# Altium schematic sheet uc3c.SchDoc
size Tabloid
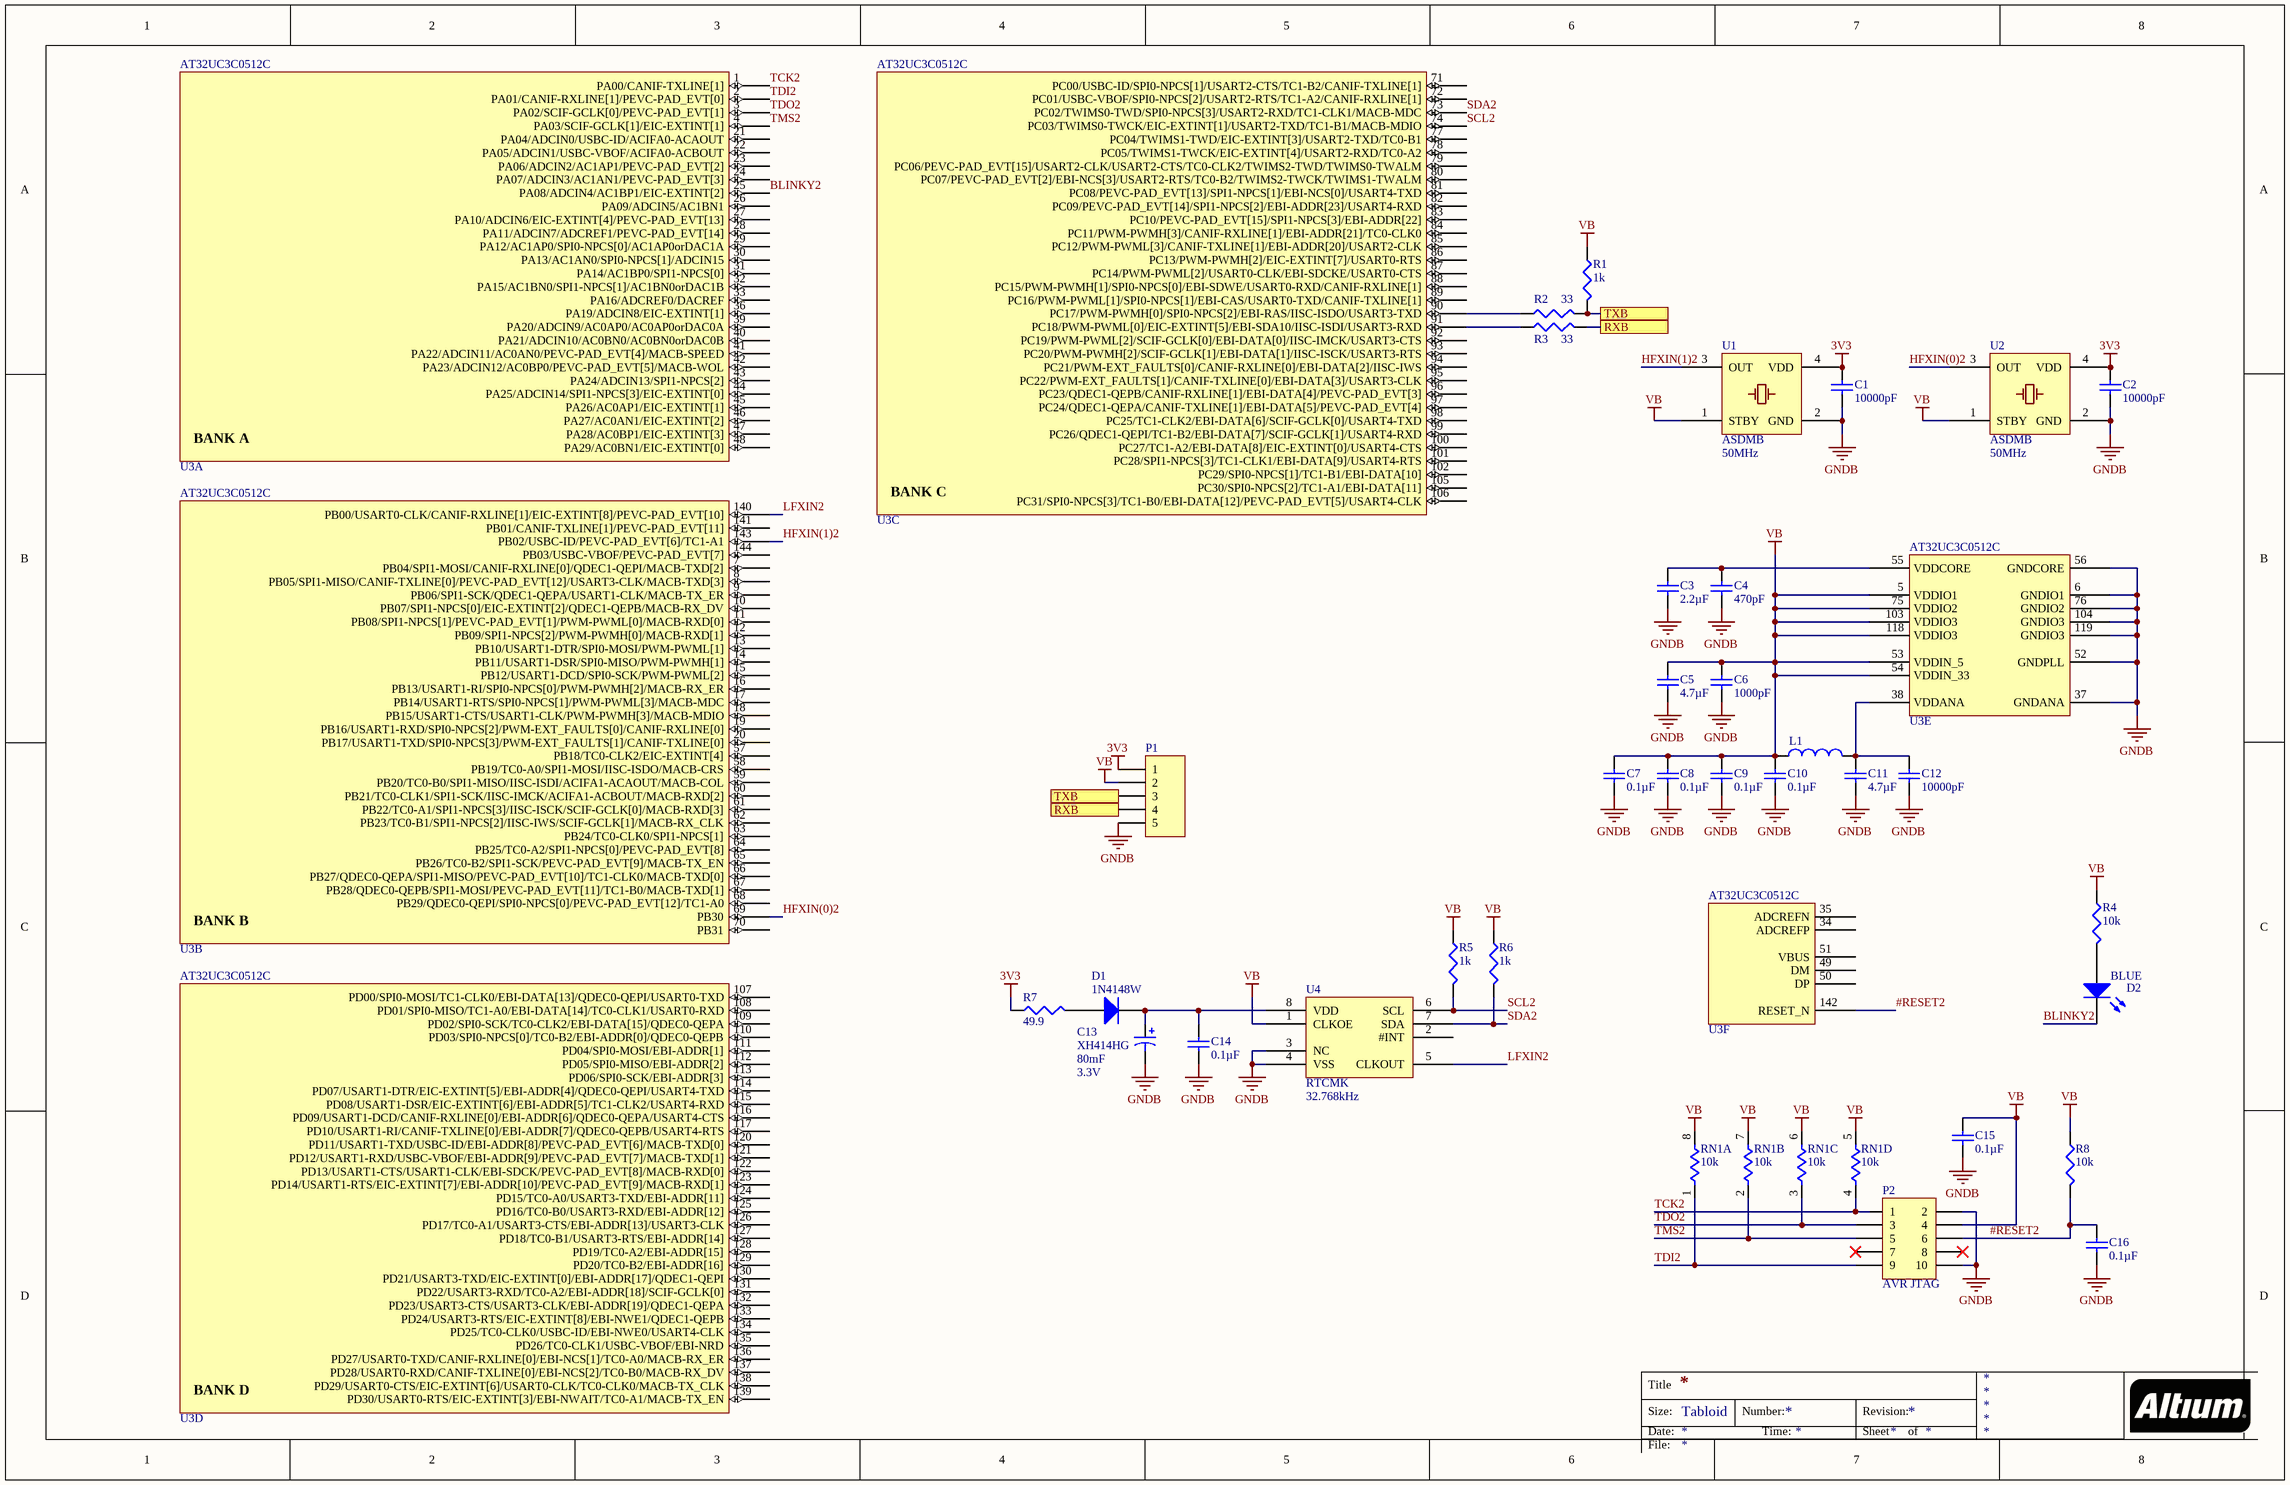
[diagram p0: uc3c.SchDoc]

## Parts
C1  value 10000pF  [TDK-CGA3E]  (hidden comment: Cap)
C2  value 10000pF  [TDK-CGA3E]  (hidden comment: Cap)
C3  value 2.2µF  [TDK-CGA3E]  (hidden comment: Cap)
C4  value 470pF  [TDK-CGA3E]  (hidden comment: Cap)
C5  value 4.7µF  [TDK-CGA4J]  (hidden comment: Cap)
C6  value 1000pF  [TDK-CGA3E]  (hidden comment: Cap)
C7  value 0.1µF  [TDK-CGA3E]  (hidden comment: Cap)
C8  value 0.1µF  [TDK-CGA3E]  (hidden comment: Cap)
C9  value 0.1µF  [TDK-CGA3E]  (hidden comment: Cap)
C10  value 0.1µF  [TDK-CGA3E]  (hidden comment: Cap)
C11  value 4.7µF  [TDK-CGA4J]  (hidden comment: Cap)
C12  value 10000pF  [TDK-CGA3E]  (hidden comment: Cap)
C13  XH414HG  value 80mF  Voltage - Rated: 3.3V  [SKI-XH414HG-IV01E]
C14  value 0.1µF  [TDK-CGA3E]  (hidden comment: Cap)
C15  value 0.1µF  [TDK-CGA3E]  (hidden comment: Cap)
C16  value 0.1µF  [TDK-CGA3E]  (hidden comment: Cap)
D1  1N4148W  [DIOD-SOD123]
D2  value BLUE  [WL-150060XS75000]  (hidden comment: LED)
L1  Inductor  [TDK-MPX1608]  (value not drawn)
P1  319-10-105-30-054000  [319-10-105-30-054000]  (value not drawn)
P2  Header 5x2  [SLN-GRPB052]  (value not drawn)
R1  value 1k  [PANA-ERJ3EK]  (hidden comment: Res3)
R2  value 33  [PANA-ERJ3EK]  (hidden comment: Res3)
R3  value 33  [PANA-ERJ3EK]  (hidden comment: Res3)
R4  value 10k  [PANA-ERJ3EK]  (hidden comment: Res3)
R5  value 1k  [PANA-ERJ3EK]  (hidden comment: Res3)
R6  value 1k  [PANA-ERJ3EK]  (hidden comment: Res3)
R7  value 49.9  [PANA-ERJ3EK]  (hidden comment: Res3)
R8  value 10k  [PANA-ERJ3EK]  (hidden comment: Res3)
RN1  value 10k  [PANA-EXB1206]  (hidden comment: Res4 Pack1)  (parts A,B,C,D of 4)
U1  ASDMB  value 50MHz  [ABR-ASDMB]
U2  ASDMB  value 50MHz  [ABR-ASDMB]
U3  AT32UC3C0512C  [MCP-LQFP144]  (parts A,B,C,D,E,F of 6)
U4  RTCMK  value 32.768kHz  [ABR-RTCMK]

## Ports
RXB, TXB

## Nets
3V3: C1.2 C2.2 P1.1 R7.2 U1.4(VDD) U2.4(VDD)
GNDB: C1.1 C2.1 C3.1 C4.1 C5.1 C6.1 C7.1 C8.1 C9.1 C10.1 C11.1 C12.1 C13.2 C14.1 C15.1 C16.2 P1.5 P2.2 P2.10 U1.2(GND) U2.2(GND) U3.6(GNDIO1) U3.37(GNDANA) U3.52(GNDPLL) U3.56(GNDCORE) U3.76(GNDIO2) U3.104(GNDIO3) U3.119(GNDIO3) U4.3(NC) U4.4(VSS)
VB: C5.2 C6.2 C7.2 C8.2 C9.2 C10.2 C15.2 L1.1 P1.2 P2.4 R1.2 R4.2 R5.2 R6.2 R8.1 RN1.5 RN1.6 RN1.7 RN1.8 U1.1(STBY) U2.1(STBY) U3.5(VDDIO1) U3.53(VDDIN_5) U3.54(VDDIN_33) U3.75(VDDIO2) U3.103(VDDIO3) U3.118(VDDIO3) U4.1(CLKOE)
#RESET2: C16.1 P2.6 R8.2 U3.142(RESET_N)
BLINKY2: D2.2(K) U3.25(PA08/ADCIN4/AC1BP1/EIC-EXTINT[2])
HFXIN(0)2: U2.3(OUT) U3.69(PB30)
HFXIN(1)2: U1.3(OUT) U3.143(PB02/USBC-ID/PEVC-PAD_EVT[6]/TC1-A1)
LFXIN2: U3.140(PB00/USART0-CLK/CANIF-RXLINE[1]/EIC-EXTINT[8]/PEVC-PAD_EVT[10]) U4.5(CLKOUT)
RXB: P1.4 R3.2 ; port RXB
SCL2: R5.1 U3.74(PC03/TWIMS0-TWCK/EIC-EXTINT[1]/USART2-TXD/TC1-B1/MACB-MDIO) U4.6(SCL)
SDA2: R6.1 U3.73(PC02/TWIMS0-TWD/SPI0-NPCS[3]/USART2-RXD/TC1-CLK1/MACB-MDC) U4.7(SDA)
TCK2: P2.1 RN1.4 U3.1(PA00/CANIF-TXLINE[1])
TDI2: P2.9 RN1.1 U3.2(PA01/CANIF-RXLINE[1]/PEVC-PAD_EVT[0])
TDO2: P2.3 RN1.3 U3.3(PA02/SCIF-GCLK[0]/PEVC-PAD_EVT[1])
TMS2: P2.5 RN1.2 U3.4(PA03/SCIF-GCLK[1]/EIC-EXTINT[1])
TXB: P1.3 R1.1 R2.2 ; port TXB
NetC3_2: C3.2 C4.2 U3.55(VDDCORE)
NetC11_2: C11.2 C12.2 L1.2 U3.38(VDDANA)
NetC13_1: C13.1 C14.2 D1.2(K) U4.8(VDD)
NetD1_1: D1.1(A) R7.1
NetD2_1: D2.1(A) R4.1
NetR2_1: R2.1 U3.90(PC17/PWM-PWMH[0]/SPI0-NPCS[2]/EBI-RAS/IISC-ISDO/USART3-TXD)
NetR3_1: R3.1 U3.91(PC18/PWM-PWML[0]/EIC-EXTINT[5]/EBI-SDA10/IISC-ISDI/USART3-RXD)

Not connected (* = marked no-connect by the designer): P2 7* 8*; U3 7(PB04/SPI1-MOSI/CANIF-RXLINE[0]/QDEC1-QEPI/MACB-TXD[2]) 8(PB05/SPI1-MISO/CANIF-TXLINE[0]/PEVC-PAD_EVT[12]/USART3-CLK/MACB-TXD[3]) 9(PB06/SPI1-SCK/QDEC1-QEPA/USART1-CLK/MACB-TX_ER) 10(PB07/SPI1-NPCS[0]/EIC-EXTINT[2]/QDEC1-QEPB/MACB-RX_DV) 11(PB08/SPI1-NPCS[1]/PEVC-PAD_EVT[1]/PWM-PWML[0]/MACB-RXD[0]) 12(PB09/SPI1-NPCS[2]/PWM-PWMH[0]/MACB-RXD[1]) 13(PB10/USART1-DTR/SPI0-MOSI/PWM-PWML[1]) 14(PB11/USART1-DSR/SPI0-MISO/PWM-PWMH[1]) 15(PB12/USART1-DCD/SPI0-SCK/PWM-PWML[2]) 16(PB13/USART1-RI/SPI0-NPCS[0]/PWM-PWMH[2]/MACB-RX_ER) 17(PB14/USART1-RTS/SPI0-NPCS[1]/PWM-PWML[3]/MACB-MDC) 18(PB15/USART1-CTS/USART1-CLK/PWM-PWMH[3]/MACB-MDIO) 19(PB16/USART1-RXD/SPI0-NPCS[2]/PWM-EXT_FAULTS[0]/CANIF-RXLINE[0]) 20(PB17/USART1-TXD/SPI0-NPCS[3]/PWM-EXT_FAULTS[1]/CANIF-TXLINE[0]) 21(PA04/ADCIN0/USBC-ID/ACIFA0-ACAOUT) 22(PA05/ADCIN1/USBC-VBOF/ACIFA0-ACBOUT) 23(PA06/ADCIN2/AC1AP1/PEVC-PAD_EVT[2]) 24(PA07/ADCIN3/AC1AN1/PEVC-PAD_EVT[3]) 26(PA09/ADCIN5/AC1BN1) 27(PA10/ADCIN6/EIC-EXTINT[4]/PEVC-PAD_EVT[13]) 28(PA11/ADCIN7/ADCREF1/PEVC-PAD_EVT[14]) 29(PA12/AC1AP0/SPI0-NPCS[0]/AC1AP0orDAC1A) 30(PA13/AC1AN0/SPI0-NPCS[1]/ADCIN15) 31(PA14/AC1BP0/SPI1-NPCS[0]) 32(PA15/AC1BN0/SPI1-NPCS[1]/AC1BN0orDAC1B) 33(PA16/ADCREF0/DACREF) 34(ADCREFP) 35(ADCREFN) 36(PA19/ADCIN8/EIC-EXTINT[1]) 39(PA20/ADCIN9/AC0AP0/AC0AP0orDAC0A) 40(PA21/ADCIN10/AC0BN0/AC0BN0orDAC0B) 41(PA22/ADCIN11/AC0AN0/PEVC-PAD_EVT[4]/MACB-SPEED) 42(PA23/ADCIN12/AC0BP0/PEVC-PAD_EVT[5]/MACB-WOL) 43(PA24/ADCIN13/SPI1-NPCS[2]) 44(PA25/ADCIN14/SPI1-NPCS[3]/EIC-EXTINT[0]) 45(PA26/AC0AP1/EIC-EXTINT[1]) 46(PA27/AC0AN1/EIC-EXTINT[2]) 47(PA28/AC0BP1/EIC-EXTINT[3]) 48(PA29/AC0BN1/EIC-EXTINT[0]) 49(DM) 50(DP) 51(VBUS) 57(PB18/TC0-CLK2/EIC-EXTINT[4]) 58(PB19/TC0-A0/SPI1-MOSI/IISC-ISDO/MACB-CRS) 59(PB20/TC0-B0/SPI1-MISO/IISC-ISDI/ACIFA1-ACAOUT/MACB-COL) 60(PB21/TC0-CLK1/SPI1-SCK/IISC-IMCK/ACIFA1-ACBOUT/MACB-RXD[2]) 61(PB22/TC0-A1/SPI1-NPCS[3]/IISC-ISCK/SCIF-GCLK[0]/MACB-RXD[3]) 62(PB23/TC0-B1/SPI1-NPCS[2]/IISC-IWS/SCIF-GCLK[1]/MACB-RX_CLK) 63(PB24/TC0-CLK0/SPI1-NPCS[1]) 64(PB25/TC0-A2/SPI1-NPCS[0]/PEVC-PAD_EVT[8]) 65(PB26/TC0-B2/SPI1-SCK/PEVC-PAD_EVT[9]/MACB-TX_EN) 66(PB27/QDEC0-QEPA/SPI1-MISO/PEVC-PAD_EVT[10]/TC1-CLK0/MACB-TXD[0]) 67(PB28/QDEC0-QEPB/SPI1-MOSI/PEVC-PAD_EVT[11]/TC1-B0/MACB-TXD[1]) 68(PB29/QDEC0-QEPI/SPI0-NPCS[0]/PEVC-PAD_EVT[12]/TC1-A0) 70(PB31) 71(PC00/USBC-ID/SPI0-NPCS[1]/USART2-CTS/TC1-B2/CANIF-TXLINE[1]) 72(PC01/USBC-VBOF/SPI0-NPCS[2]/USART2-RTS/TC1-A2/CANIF-RXLINE[1]) 77(PC04/TWIMS1-TWD/EIC-EXTINT[3]/USART2-TXD/TC0-B1) 78(PC05/TWIMS1-TWCK/EIC-EXTINT[4]/USART2-RXD/TC0-A2) 79(PC06/PEVC-PAD_EVT[15]/USART2-CLK/USART2-CTS/TC0-CLK2/TWIMS2-TWD/TWIMS0-TWALM) 80(PC07/PEVC-PAD_EVT[2]/EBI-NCS[3]/USART2-RTS/TC0-B2/TWIMS2-TWCK/TWIMS1-TWALM) 81(PC08/PEVC-PAD_EVT[13]/SPI1-NPCS[1]/EBI-NCS[0]/USART4-TXD) 82(PC09/PEVC-PAD_EVT[14]/SPI1-NPCS[2]/EBI-ADDR[23]/USART4-RXD) 83(PC10/PEVC-PAD_EVT[15]/SPI1-NPCS[3]/EBI-ADDR[22]) 84(PC11/PWM-PWMH[3]/CANIF-RXLINE[1]/EBI-ADDR[21]/TC0-CLK0) 85(PC12/PWM-PWML[3]/CANIF-TXLINE[1]/EBI-ADDR[20]/USART2-CLK) 86(PC13/PWM-PWMH[2]/EIC-EXTINT[7]/USART0-RTS) 87(PC14/PWM-PWML[2]/USART0-CLK/EBI-SDCKE/USART0-CTS) 88(PC15/PWM-PWMH[1]/SPI0-NPCS[0]/EBI-SDWE/USART0-RXD/CANIF-RXLINE[1]) 89(PC16/PWM-PWML[1]/SPI0-NPCS[1]/EBI-CAS/USART0-TXD/CANIF-TXLINE[1]) 92(PC19/PWM-PWML[2]/SCIF-GCLK[0]/EBI-DATA[0]/IISC-IMCK/USART3-CTS) 93(PC20/PWM-PWMH[2]/SCIF-GCLK[1]/EBI-DATA[1]/IISC-ISCK/USART3-RTS) 94(PC21/PWM-EXT_FAULTS[0]/CANIF-RXLINE[0]/EBI-DATA[2]/IISC-IWS) 95(PC22/PWM-EXT_FAULTS[1]/CANIF-TXLINE[0]/EBI-DATA[3]/USART3-CLK) 96(PC23/QDEC1-QEPB/CANIF-RXLINE[1]/EBI-DATA[4]/PEVC-PAD_EVT[3]) 97(PC24/QDEC1-QEPA/CANIF-TXLINE[1]/EBI-DATA[5]/PEVC-PAD_EVT[4]) 98(PC25/TC1-CLK2/EBI-DATA[6]/SCIF-GCLK[0]/USART4-TXD) 99(PC26/QDEC1-QEPI/TC1-B2/EBI-DATA[7]/SCIF-GCLK[1]/USART4-RXD) 100(PC27/TC1-A2/EBI-DATA[8]/EIC-EXTINT[0]/USART4-CTS) 101(PC28/SPI1-NPCS[3]/TC1-CLK1/EBI-DATA[9]/USART4-RTS) 102(PC29/SPI0-NPCS[1]/TC1-B1/EBI-DATA[10]) 105(PC30/SPI0-NPCS[2]/TC1-A1/EBI-DATA[11]) 106(PC31/SPI0-NPCS[3]/TC1-B0/EBI-DATA[12]/PEVC-PAD_EVT[5]/USART4-CLK) 107(PD00/SPI0-MOSI/TC1-CLK0/EBI-DATA[13]/QDEC0-QEPI/USART0-TXD) 108(PD01/SPI0-MISO/TC1-A0/EBI-DATA[14]/TC0-CLK1/USART0-RXD) 109(PD02/SPI0-SCK/TC0-CLK2/EBI-DATA[15]/QDEC0-QEPA) 110(PD03/SPI0-NPCS[0]/TC0-B2/EBI-ADDR[0]/QDEC0-QEPB) 111(PD04/SPI0-MOSI/EBI-ADDR[1]) 112(PD05/SPI0-MISO/EBI-ADDR[2]) 113(PD06/SPI0-SCK/EBI-ADDR[3]) 114(PD07/USART1-DTR/EIC-EXTINT[5]/EBI-ADDR[4]/QDEC0-QEPI/USART4-TXD) 115(PD08/USART1-DSR/EIC-EXTINT[6]/EBI-ADDR[5]/TC1-CLK2/USART4-RXD) 116(PD09/USART1-DCD/CANIF-RXLINE[0]/EBI-ADDR[6]/QDEC0-QEPA/USART4-CTS) 117(PD10/USART1-RI/CANIF-TXLINE[0]/EBI-ADDR[7]/QDEC0-QEPB/USART4-RTS) 120(PD11/USART1-TXD/USBC-ID/EBI-ADDR[8]/PEVC-PAD_EVT[6]/MACB-TXD[0]) 121(PD12/USART1-RXD/USBC-VBOF/EBI-ADDR[9]/PEVC-PAD_EVT[7]/MACB-TXD[1]) 122(PD13/USART1-CTS/USART1-CLK/EBI-SDCK/PEVC-PAD_EVT[8]/MACB-RXD[0]) 123(PD14/USART1-RTS/EIC-EXTINT[7]/EBI-ADDR[10]/PEVC-PAD_EVT[9]/MACB-RXD[1]) 124(PD15/TC0-A0/USART3-TXD/EBI-ADDR[11]) 125(PD16/TC0-B0/USART3-RXD/EBI-ADDR[12]) 126(PD17/TC0-A1/USART3-CTS/EBI-ADDR[13]/USART3-CLK) 127(PD18/TC0-B1/USART3-RTS/EBI-ADDR[14]) 128(PD19/TC0-A2/EBI-ADDR[15]) 129(PD20/TC0-B2/EBI-ADDR[16]) 130(PD21/USART3-TXD/EIC-EXTINT[0]/EBI-ADDR[17]/QDEC1-QEPI) 131(PD22/USART3-RXD/TC0-A2/EBI-ADDR[18]/SCIF-GCLK[0]) 132(PD23/USART3-CTS/USART3-CLK/EBI-ADDR[19]/QDEC1-QEPA) 133(PD24/USART3-RTS/EIC-EXTINT[8]/EBI-NWE1/QDEC1-QEPB) 134(PD25/TC0-CLK0/USBC-ID/EBI-NWE0/USART4-CLK) 135(PD26/TC0-CLK1/USBC-VBOF/EBI-NRD) 136(PD27/USART0-TXD/CANIF-RXLINE[0]/EBI-NCS[1]/TC0-A0/MACB-RX_ER) 137(PD28/USART0-RXD/CANIF-TXLINE[0]/EBI-NCS[2]/TC0-B0/MACB-RX_DV) 138(PD29/USART0-CTS/EIC-EXTINT[6]/USART0-CLK/TC0-CLK0/MACB-TX_CLK) 139(PD30/USART0-RTS/EIC-EXTINT[3]/EBI-NWAIT/TC0-A1/MACB-TX_EN) 141(PB01/CANIF-TXLINE[1]/PEVC-PAD_EVT[11]) 144(PB03/USBC-VBOF/PEVC-PAD_EVT[7]); U4 2(#INT)

## Notes on the sheet
- (near P2) AVR JTAG
- Title
- Size:
- Date:
- Tabloid
- Number:
- Time:
- Revision:
- Sheet
- of
- File:
- (in symbol PU-MCP-00005, part A) BANK A
- (in symbol PU-MCP-00005, part B) BANK B
- (in symbol PU-MCP-00005, part C) BANK C
- (in symbol PU-MCP-00005, part D) BANK D

## Library data of the parts
C1 C2 C12 = PC-TDK-01883: CAP CER 10000PF 100V C0G 0603; Manufacturer Part Number: CGA3E1C0G2A103J080AC; Index: 1883; Designator: C?; Tolerance: ±5%; Temperature Coefficient: NP0; Published: 3/16/2016; LatestRevisionDate: 3/16/2016; LatestRevisionNote: ...; PackageReference: 0603 (1608 Metric); Publisher: AlbertaSat; PackageDescription: Radial Cap, Thru-Hole; 2 Leads; 0.3 in Pin Spacing; Part Number: PC-TDK-01883; Supplier Part Number 1: 445-172688-1-ND; Supplier 1: Digi-key; Supplier Link: http://www.digikey.ca/product-search/en?keywords=445-172688-1-ND; Voltage - Rated: 100V; Applications: Automotive
C3 = PC-TDK-02725: CAP CER 2.2UF 6.3V X7R 0603; Manufacturer Part Number: CGA3E1X7R0J225K080AC; Index: 2725; Designator: C?; Tolerance: ±10%; Published: 2016-03-16; LatestRevisionDate: 2016-03-16; LatestRevisionNote: ...; PackageReference: 0603 (1608 Metric); Publisher: AlbertaSat; PackageDescription: Radial Cap, Thru-Hole; 2 Leads; 0.3 in Pin Spacing; Part Number: PC-TDK-02725; Supplier Part Number 1: 445-6933-1-ND; Supplier 1: Digi-key; Supplier Link: http://www.digikey.ca/product-search/en?keywords=445-6933-1-ND; Voltage - Rated: 6.3V; Temperature Coefficient: X7R; Applications: Automotive
C4 = PC-TDK-01388: CAP CER 470PF 250V C0G 0603; Manufacturer Part Number: CGA3E3C0G2E471J080AA; Index: 1388; Tolerance: ±5%; Temperature Coefficient: NP0; Published: 3/16/2016; LatestRevisionDate: 3/16/2016; LatestRevisionNote: ...; PackageReference: 0603 (1608 Metric); Publisher: AlbertaSat; PackageDescription: Radial Cap, Thru-Hole; 2 Leads; 0.3 in Pin Spacing; Part Number: PC-TDK-01388; Supplier Part Number 1: 445-5746-1-ND; Supplier 1: Digi-key; Supplier Link: http://www.digikey.ca/product-search/en?keywords=445-5746-1-ND; Voltage - Rated: 250V; Applications: Automotive
C5 C11 = PC-TDK-02830: CAP CER 4.7UF 25V X7R 0805; Manufacturer Part Number: CGA4J1X7R1E475K125AC; Index: 2830; Tolerance: ±10%; Published: 3/16/2016; LatestRevisionDate: 3/16/2016; LatestRevisionNote: ...; PackageReference: 0805 (2012 Metric); Publisher: AlbertaSat; PackageDescription: Radial Cap, Thru-Hole; 2 Leads; 0.3 in Pin Spacing; Part Number: PC-TDK-02830; Supplier Part Number 1: 445-6967-1-ND; Supplier 1: Digi-key; Supplier Link: http://www.digikey.ca/product-search/en?keywords=445-6967-1-ND; Voltage - Rated: 25V; Temperature Coefficient: X7R; Applications: Automotive
C6 = PC-TDK-01478: CAP CER 1000PF 50V NP0 0603; Manufacturer Part Number: CGA3E2NP01H102J080AA; Index: 1478; Tolerance: ±5%; Published: 3/16/2016; LatestRevisionDate: 3/16/2016; LatestRevisionNote: ...; PackageReference: 0603 (1608 Metric); Publisher: AlbertaSat; PackageDescription: Radial Cap, Thru-Hole; 2 Leads; 0.3 in Pin Spacing; Part Number: PC-TDK-01478; Supplier Part Number 1: 445-12385-1-ND; Supplier 1: Digi-key; Supplier Link: http://www.digikey.ca/product-search/en?keywords=445-12385-1-ND; Voltage - Rated: 50V; Temperature Coefficient: NP0; Applications: Automotive
C7-C10 C14-C16 = PC-TDK-02272: CAP CER 0.1UF 50V X8R 0603; Manufacturer Part Number: CGA3E3X8R1H104K080AB; Index: 2272; Tolerance: ±10%; Published: 3/16/2016; LatestRevisionDate: 3/16/2016; LatestRevisionNote: ...; PackageReference: 0603 (1608 Metric); Publisher: AlbertaSat; PackageDescription: Radial Cap, Thru-Hole; 2 Leads; 0.3 in Pin Spacing; Part Number: PC-TDK-02272; Supplier Part Number 1: 445-12606-1-ND; Supplier 1: Digi-key; Supplier Link: http://www.digikey.ca/product-search/en?keywords=445-12606-1-ND; Voltage - Rated: 50V; Temperature Coefficient: X8R; Applications: Automotive
C13 = PC-SKI-00001: CAP 80MF 3.3V SURFACE MOUNT; Manufacturer Part Number: XH414HG-IV01E; Index: 1; Designator: C?; Published: 2018-04-25; LatestRevisionDate: 2018-04-25; LatestRevisionNote: ...; PackageReference: 0.189" Dia (4.80mm); Publisher: AlbertaSat; PackageDescription: Polarized Capacitor (Radial); 2 Leads; Part Number: PC-SKI-00001; Supplier Part Number 1: 728-1050-1-ND; Supplier 1: Digi-key; Supplier Part Number 2: 628-XH414HG-IV01E; Supplier 2: Mouser; Supplier Link: #https://www.digikey.ca/product-detail/en/seiko-instruments/XH414HG-IV01E/728-1050-1-ND/1889211#
D1 = 26: DIODE GEN PURP 100V 300MA SOD123; Part Number: 26; Manufacturer Part Number: 1N4148W-7-F; Designator: D?; Voltage - DC Reverse: 1.25V @ 150mA; Published: 8-Jun-2000; LatestRevisionDate: 17-Jul-2002; LatestRevisionNote: Re-released for DXP Platform.; PackageVersion: Sep-1996; PackageReference: DIOD-SOD123; Publisher: Altium Limited; PackageDescription: DO-214-AB/SMC; 2 C-Bend Leads; Body 7.9 x 5.9 mm, inc. leads (LxW); Code_JEDEC: DO-214-AB; Supplier Part Number 1: 1N4148W-FDICT-ND; Supplier 1: Digi-Key; Supplier Link: #https://www.digikey.ca/product-detail/en/diodes-incorporated/1N4148W-7-F/1N4148W-FDICT-ND/815280#; Voltage - Reverse Standoff (Typ): 100V; Current - Peak Pulse: 300mA
D2 = 4: LED BLUE CLEAR 0603 SMD; Part Number: 4; Manufacturer Part Number: 150060BS75000; Designator: D?; Brightness: 145mcd; Published: 8-Jun-2000; LatestRevisionDate: 08-Jul-2005; LatestRevisionNote: Mech Layer 1 removed.; PackageReference: WL-150060XS75000; Publisher: Altium Limited; PackageDescription: LED; 2 Leads; Supplier Part Number 1: 732-4966-1-ND; Supplier 1: Digi-Key; Supplier Link: http://www.digikey.ca/product-search/en?keywords=732-4966-1-ND
L1 = PL-TDK-02954: FERRITE BEAD 1 KOHM 0603 1LN; Manufacturer Part Number: MPZ1608S102ATD25; Code_IEC: 1608; Value: 1 kOhm @ 100MHz; Index: 2954; Designator: L?; Current - Rated: 800mA; Published: 7/8/2017; LatestRevisionDate: 7/8/2017; LatestRevisionNote: ...; PackageReference: 0603 (1608 Metric); Publisher: AlbertaSat; PackageDescription: Chip Inductor, 2-Leads, Body 1.60x0.80mm, IPC Low Density; Code_JEITA: 0603; Part Number: PL-TDK-02954; Supplier Part Number 1: 445-172890-1-ND; Supplier 1: Digi-key; Supplier Part Number 2: 810-MPZ1608S102ATD25; Supplier 2: Mouser; Supplier Link: #https://www.digikey.ca/product-detail/en/tdk-corporation/MPZ1608S102ATD25/445-172890-1-ND/5040521#; Applications: Automotive
P1 = PP-MMM-00002: LOW PROFILE SLC TARGET CONNECTOR; Index: 2; Designator: P?; LatestRevisionDate: 2018-05-10; LatestRevisionNote: ...; Publisher: AlbertaSat; Part Number: PP-MMM-00002; Manufacturer Part Number: 319-10-105-30-054000; Supplier Part Number 1: ED10781-ND; Supplier 1: Digi-key; Supplier Part Number 2: 575-3191010530054000; Supplier 2: Mouser; Published: 2018-05-10; Supplier Link: #https://www.digikey.ca/product-detail/en/mill-max-manufacturing-corp/319-10-105-30-054000/ED10781-ND/6243896#
P2 = PP-SLN-00017: CONN HEADER .050"" 10PS DL PCB AU; Manufacturer Part Number: GRPB052VWVN-RC; Index: 17; Number of Positions: 10; LatestRevisionDate: 3/16/2016; LatestRevisionNote: ...; Publisher: AlbertaSat; Part Number: PP-SLN-00017; Supplier Part Number 1: S9015E-05-ND; Supplier 1: Digi-key; Published: 3/16/2016; PackageReference: SLN-GRPB052; PackageDescription: CONN HEADER .050"" 10PS DL PCB AU; Supplier Link: http://www.digikey.ca/product-search/en?keywords=S9015E-05-ND; Number of Rows: 2
R1 R5 R6 = 15398: RES SMD 1K OHM 1% 1/10W 0603; Part Number: 15398; Manufacturer Part Number: ERJ-3EKF1001V; Designator: R?; Power: 0.1W, 1/10W; Temperature Coefficient: ±100ppm/°C; Published: 8-Jun-2000; LatestRevisionDate: 29-May-2009; LatestRevisionNote: IPC-7351 Footprint Added.; PackageReference: 0603 (1608 Metric); Publisher: Altium Limited; PackageDescription: Chip Resistor, 2-Leads, Body 1.60x0.80mm, IPC Low Density; Supplier Part Number 1: P1.00KHCT-ND; Supplier 1: Digi-Key; Supplier Link: http://www.digikey.ca/product-search/en?keywords=P1.00KHCT-ND; Tolerance: ±1%
R2 R3 = 13588: RES SMD 33 OHM 1% 1/10W 0603; Part Number: 13588; Manufacturer Part Number: ERJ-3EKF33R0V; Designator: R?; Power: 0.1W, 1/10W; Temperature Coefficient: ±100ppm/°C; Published: 8-Jun-2000; LatestRevisionDate: 29-May-2009; LatestRevisionNote: IPC-7351 Footprint Added.; PackageReference: 0603 (1608 Metric); Publisher: Altium Limited; PackageDescription: Chip Resistor, 2-Leads, Body 1.60x0.80mm, IPC Low Density; Supplier Part Number 1: P33.0HCT-ND; Supplier 1: Digi-Key; Supplier Link: http://www.digikey.ca/product-search/en?keywords=P33.0HCT-ND; Tolerance: ±1%
R4 R8 = 17203: RES SMD 10K OHM 1% 1/10W 0603; Part Number: 17203; Manufacturer Part Number: ERJ-3EKF1002V; Designator: R?; Power: 0.1W, 1/10W; Temperature Coefficient: ±100ppm/°C; Published: 8-Jun-2000; LatestRevisionDate: 29-May-2009; LatestRevisionNote: IPC-7351 Footprint Added.; PackageReference: 0603 (1608 Metric); Publisher: Altium Limited; PackageDescription: Chip Resistor, 2-Leads, Body 1.60x0.80mm, IPC Low Density; Supplier Part Number 1: P10.0KHCT-ND; Supplier 1: Digi-Key; Supplier Link: http://www.digikey.ca/product-search/en?keywords=P10.0KHCT-ND; Tolerance: ±1%
R7 = 13734: RES SMD 49.9 OHM 1% 1/10W 0603; Part Number: 13734; Manufacturer Part Number: ERJ-3EKF49R9V; Designator: R?; Power: 0.1W, 1/10W; Temperature Coefficient: ±100ppm/°C; Published: 8-Jun-2000; LatestRevisionDate: 29-May-2009; LatestRevisionNote: IPC-7351 Footprint Added.; PackageReference: 0603 (1608 Metric); Publisher: Altium Limited; PackageDescription: Chip Resistor, 2-Leads, Body 1.60x0.80mm, IPC Low Density; Supplier Part Number 1: P49.9HCT-ND; Supplier 1: Digi-Key; Supplier Link: http://www.digikey.ca/product-search/en?keywords=P49.9HCT-ND; Tolerance: ±1%
RN1 = 19842: RES ARRAY 4 RES 10K OHM 1206; Part Number: 19842; Manufacturer Part Number: EXB-38V103JV; Sim Note: Enter the Resistance value into parameter field.; Designator: RN?; Tolerance: ±5%; Power: 62.5mW; Temperature Coefficient: ±200ppm/°C; Code_JEDEC: MS-012-AC; Supplier Part Number 1: Y9103CT-ND; Supplier 1: Digi-Key; Supplier Link: http://www.digikey.ca/product-search/en?keywords=Y9103CT-ND; PackageReference: 1206 (3216 Metric), Convex, Long Side Terminals; PackageDescription: Chip Array, ConvexS, 8-Leads, Pitch 0.80mm,  Body 3.20x1.60mm,  IPC Low Density
U1 U2 = PU-ABR-00030: OSC MEMS 50.000MHZ CMOS SMD; Manufacturer Part Number: ASDMB-50.000MHZ-XY-T; Index: 30; Designator: U?; Tolerance: ±10ppm; Part Number: PU-ABR-00030; Supplier Part Number 1: 535-11167-1-ND; Supplier 1: Digi-key; Supplier Part Number 2: 815-ASDMB-50-XY-T; Supplier 2: Mouser; Publisher: AlbertaSat; Published: 2017-10-24; LatestRevisionDate: 2017-10-24; LatestRevisionNote: ...; PackageReference: 4-SMD, No Lead; PackageDescription: DFN, 4-Leads, Body 2.00x2.50mm, Pitch 1.65mm, IPC Low Density; Supplier Link: http://www.digikey.ca/product-search/en?keywords=535-11167-1-ND
U3 = PU-MCP-00005: IC MCU 32BIT 512KB FLASH 144LQFP; Manufacturer Part Number: AT32UC3C0512C-ALZR; Index: 5; Designator: U?; Core Processor: AVR; Core Size: 32-Bit; Speed: 50MHz; Program Memory Size: 512KB (512K x 8); RAM Size: 64K x 8; Part Number: PU-MCP-00005; Supplier Part Number 1: AT32UC3C0512C-ALZRTR-ND / AT32UC3C0512C-ALZRTR-ND; Supplier 1: Digi-key; Supplier Part Number 2: AT32UC3C0512C-ALZR; Supplier 2: Verical; Publisher: AlbertaSat; Published: 2018-04-18; LatestRevisionDate: 2018-04-18; LatestRevisionNote: ...; PackageReference: 144-LQFP; Supplier Link: #https://www.digikey.ca/product-detail/en/microchip-technology/AT32UC3C0512C-ALZR/AT32UC3C0512C-ALZRTR-ND/4517167#; Operating Temperature: -40°C ~ 125°C (TA)
U4 = PU-ABR-00037: IC RTC CLK/CALENDAR I2C 8-SMT; Manufacturer Part Number: AB-RTCMK-32.768KHZ-T3; Index: 37; Designator: U?; Part Number: PU-ABR-00037; Supplier Part Number 1: 535-11916-1-ND; Supplier 1: Digi-key; Supplier Part Number 2: 815-AB-RTCMK-32.7KT3; Supplier 2: Mouser; Publisher: AlbertaSat; Published: 4/23/2018; LatestRevisionDate: 4/23/2018; LatestRevisionNote: ...; PackageReference: 8-SMD Module; PackageDescription: 8-SMD Module; Supplier Link: https://www.digikey.ca/product-detail/en/abracon-llc/AB-RTCMK-32.768KHZ-T3/535-11916-1-ND/3601050